# Altium schematic sheet Buck-SCH.SchDoc: "Buck Converter"
size 199 x 199 mm; SheetNumber: 1; SheetTotal: 1
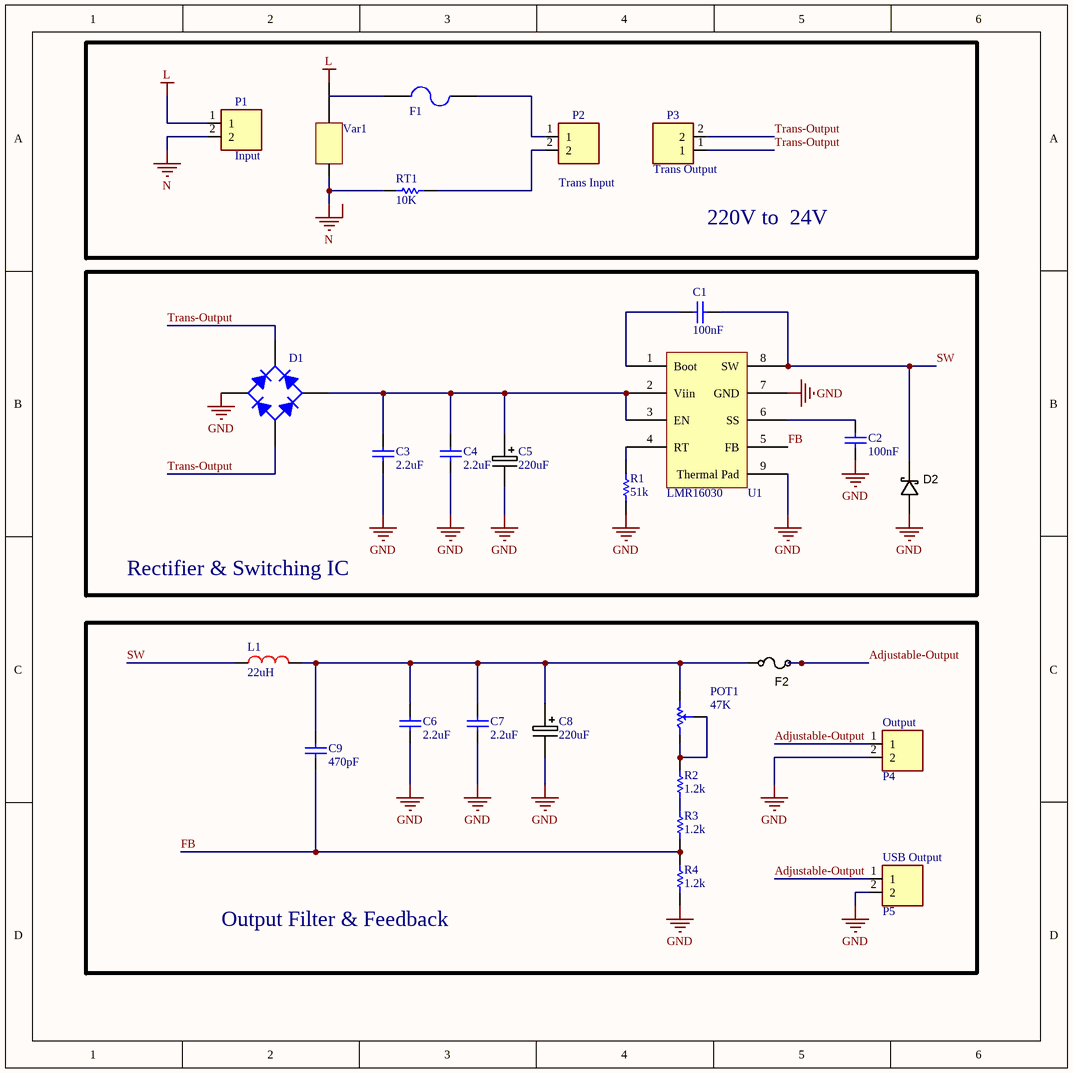
[diagram p0: Buck-SCH.SchDoc]

## Parts
C1  100nF  [CAP0603]
C2  100nF  [CAP0603]
C3  2.2uF  [CAP0805]
C4  2.2uF  [CAP0805]
C5  220uF  [PANACAP-F-GENERIC]
C6  2.2uF  [CAP0805]
C7  2.2uF  [CAP0805]
C8  220uF  [PANACAP-F-GENERIC]
C9  470pF  [CAP0603]
D1  Diode Bridge  [Bridge KBU PACKAGE]  (value not drawn)
D2  schottky diode  [DO-214AB]  (value not drawn)
F1  F=1.0 A  [Fuse 5x20 With holder pin]  (value not drawn)
F2  Slow-blow  [RESC3216X70N]  (value not drawn)
L1  22uH  [Inductor]
P1  Input  [MSTBF_2]
P2  Trans Input  [MSTBF_2]
P3  Trans Output  [MSTBF_2]
P4  Output  [MSTBF_2]
P5  USB Output  [MSTBF_2]
POT1  47K  [POT]
R1  51k  [RESC3413X04N]
R2  1.2k  [RESC3413X04N]
R3  1.2k  [RESC3413X04N]
R4  1.2k  [RESC3413X04N]
RT1  10K  [RES0402]
U1  LMR16030  [U?]
Var1  Varistor  [Varistor]  (value not drawn)

## Blocks framed on the sheet
220V to  24V: F1 P1-P3 RT1 Var1
Rectifier & Switching IC: C1-C5 D1 D2 R1 U1
Output Filter & Feedback: C6-C9 F2 L1 P4 P5 POT1 R2-R4

## Nets
GND: C2.1 C3.1 C4.1 C5.- C6.1 C7.1 C8.- D1.2(AC) D2.A P4.2 P5.2 R1.1 R4.1 U1.7(GND) U1.9(Thermal_Pad)
L: P1.1
N: P1.2 RT1.1
Adjustable-Output: F2.2 P4.1 P5.1
FB: C9.1 R3.1 R4.2 U1.5(FB)
SW: C1.1 D2.K U1.8(SW)
Trans-Output: D1.1(+) D1.4(-) P3.1 P3.2
NetC1_2: C1.2 U1.1(Boot)
NetC2_2: C2.2 U1.6(SS)
NetC3_2: C3.2 C4.2 C5.+ D1.3(AC) U1.2(Viin) U1.3(EN)
NetC6_2: C6.2 C7.2 C8.+ C9.2 F2.1 POT1.2(CW)
NetF1_2: F1.2 P2.1
NetP2_2: P2.2 RT1.2
NetPOT1_1: POT1.1(CCW) POT1.3(SetPoint) R2.2
NetR1_2: R1.2 U1.4(RT)
NetR2_1: R2.1 R3.2

Not connected (* = marked no-connect by the designer): F1 1; L1 1 2; Var1 1 2

## Notes on the sheet
- Labels drawn without touching a wire or pin: L

## Library data of the parts
C1 C2 = CAP SMD PACKAGE: 100nF-0603; Designer: Abbas Basereh; Desc.: CAP SMD TOTAL PACKAGES; Data: 2017-3-10; VALUE: 100nF
C3 C4 C6 C7 = CAP SMD PACKAGE: 2.2UF-0805; Designer: Abbas Basereh; Desc.: CAP SMD TOTAL PACKAGES; VALUE: 100nF; Data: 2017-3-10
C5 C8 = PANACAP-47UF-63V-FK: 220uF-63V; Supplier 1: Digi-Key; Supplier Part Number 1: PCE3823TR-ND
C9 = CAP SMD PACKAGE: 470pF-0603; Designer: Abbas Basereh; Desc.: CAP SMD TOTAL PACKAGES; VALUE: 100nF; Data: 2017-3-10
D1 = Diode Bridge TOTAL SIZE: Full Wave Diode Bridge; Designer: Abbas Basereh; Design Date: 1395/11/09; ComponentLink1Description: Datasheet; ComponentLink2Description: Reference; Mounting Technology: Surface Mount\Through-Hole; Status: Unreleased
D2 = DIODE_SCHOTTKY_30BQ100TRPBF: Diode Schottky SMD 40V 3A SMC; Manufacturer 1: Vishay/Semiconductors; Material: Si; Speed: Fast Recovery =< 500ns, > 200mA (Io); SCDType: source; Ratings: 40V 3A; Package / Case: DO-214AB, SMC; Diode Type: Schottky; Mounting Type: Surface Mount; Supplier 1: Digi-Key; Manufacturer Part Number 1: 30BQ100TRPBF; Supplier Part Number 1: 30BQ100PBFCT-ND
F1 = Fuse 5x20 with holdeer pins: Fuses 5x20; Designer: Abbas Basereh; Desc.: fuse with holder pins 5x20; Data: 28-12-2016
F2 = FUSE_160mA_1206: Fuse 4A 1206 SMD; Manufacturer 1: Holly Fuse; Manufacturer Part Number 1: 12T-0160L; Ratings: 160mA; 63VDC; slow-blow; SCDType: spec; Package / Case: 1206 (3216 metric); Value: 4A
L1 = Inductor
P1-P5 = CONN_PWL_2: Power Terminal 2pin,Header, 2-Pin; VALUE: CONN_PWL_2
POT1 = POT: POT-47K; Value: 47K
R1 = RES 0805 0.125W: 51K-0805; Designer: Abbas Basereh; Desc.: RES SMD 0805; Data: 16-12-2016
R2-R4 = RES 0805 0.125W: 1.2k-0805; Designer: Abbas Basereh; Desc.: RES SMD 0805; Data: 16-12-2016
RT1 = RES SMD PACKAGE: NTC 10K 0402; Designer: Abbas Basereh; Desc.: RES SMD PAKAGES; Data: 2017-3-10